# EAGLE design SensorBoard (EAGLE 9.6.2)
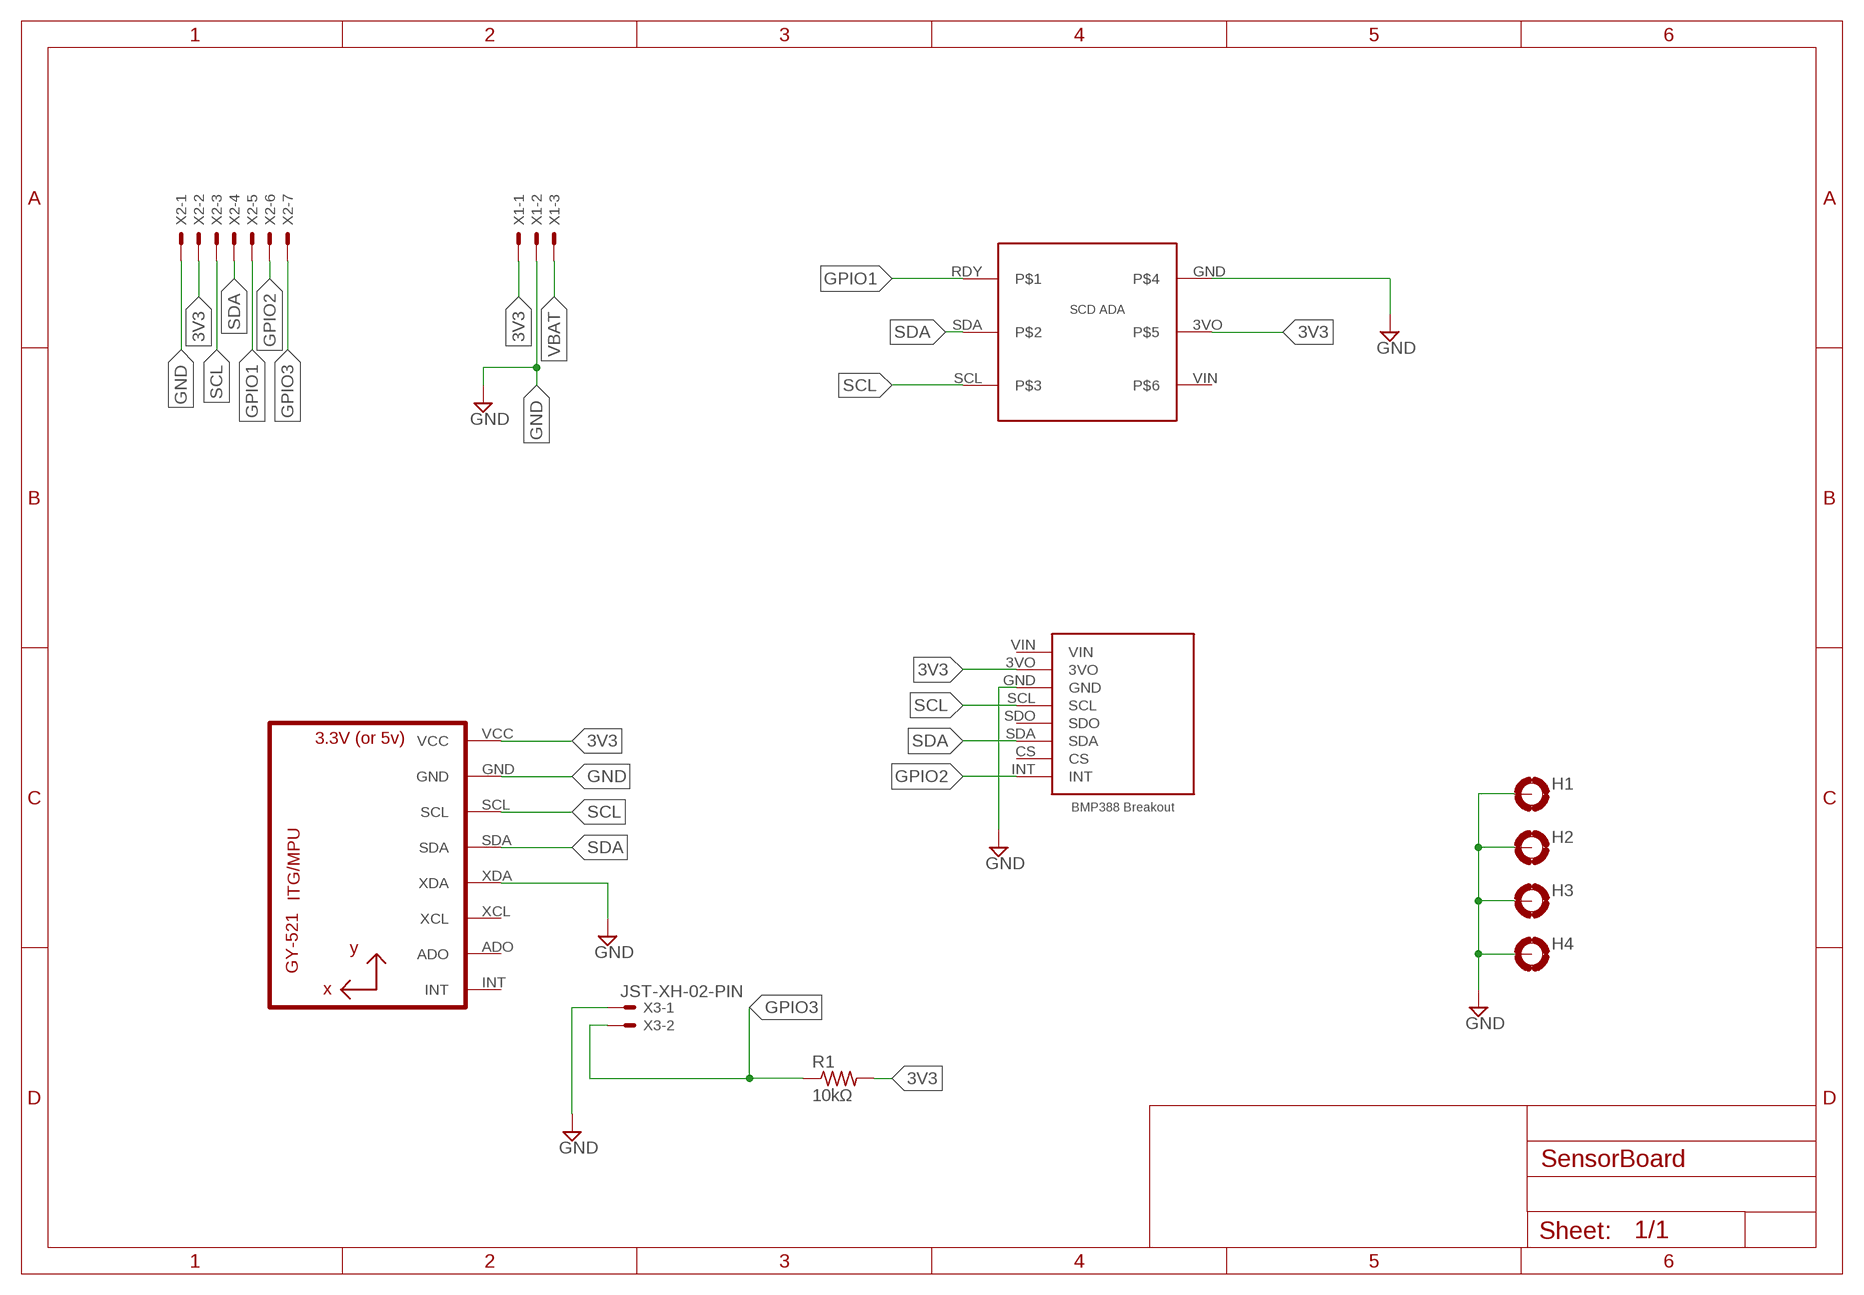
[diagram p0: schematic, sheet 1]

## Parts
H1  MOUNT-PAD-ROUND3.0  [3,0-PAD]
H2  MOUNT-PAD-ROUND3.0  [3,0-PAD]
H3  MOUNT-PAD-ROUND3.0  [3,0-PAD]
H4  MOUNT-PAD-ROUND3.0  [3,0-PAD]
R1  10kΩ  R-US_0204/7  [0204/7]
U1  GY-521MPU6050  [GY-521]
U$2  BMP388BREAKOUT  [BMP388BREAKOUT]
U$6  SCD30_ADA  [SCD30_ADA]
X1  JST-XH-03-PIN  [JST-XH_S3B]
X2  JST-XH-07-PIN  [JST-XH_S7B]
X3  JST-XH-02-PIN  [JST-XH_S2B]

## Nets
3V3: R1.2 U1.VCC U$2.3VO U$6.3VO X1.PIN1 X2.PIN2
GND: H1.B3,0(MOUNT) H2.B3,0(MOUNT) H3.B3,0(MOUNT) H4.B3,0(MOUNT) U1.GND U1.XDA U$2.GND U$6.GND X1.PIN2 X2.PIN1 X3.PIN1
GPIO1: U$6.RDY X2.PIN5
GPIO2: U$2.INT X2.PIN6
GPIO3: R1.1 X2.PIN7 X3.PIN2
SCL: U1.SCL U$2.SCL U$6.SCL X2.PIN3
SDA: U1.SDA U$2.SDA U$6.SDA X2.PIN4
VBAT: X1.PIN3
Unconnected: U1.ADO U1.INT U1.XCL U$2.CS U$2.SDO U$2.VIN U$6.VIN

## Library data of the parts
H1-H4 = holes:MOUNT-PAD-ROUND: MOUNTING PAD, round
R1 = rcl:R-US_: RESISTOR, American symbol; SPICEPREFIX: R
U1 = GY-521:GY-521: Check availability <https://pricing.snapeda.com/parts/GY-521/GODREAM%20FORDREAM%20CO.%2C%20LIMITED/view-part?ref=eda>; AVAILABILITY: Not in stock; CHECK_PRICES: https://www.snapeda.com/parts/GY-521/GODREAM+FORDREAM+CO.%252C+LIMITED/view-part/?ref=eda; DESCRIPTION: Triple Axis Accelerometer Gyro Breakout; MF: GODREAM FORDREAM CO., LIMITED; MP: GY-521; PACKAGE: Package; PRICE: None; SNAPEDA_LINK: https://www.snapeda.com/parts/GY-521/GODREAM+FORDREAM+CO.%252C+LIMITED/view-part/?ref=snap
U$2 = Breakouts:BMP388BREAKOUT: Adafruit BMP388 - Precision Barometric Pressure and Altimeter - STEMMA QT https://www.adafruit.com/product/3966
U$6 = SCD30:SCD30_ADA
X1 = JST-XH Connectors:JST-XH-03-PIN: JST XH Connector 2 Pin Wire to board connector. Pitch: 2,54 mm, (0.100") Number of pins: 3 Created by Rembrandt Electronics www.rembrandtelectronics.com
X2 = JST-XH Connectors:JST-XH-07-PIN: JST XH Connector 2 Pin Wire to board connector. Pitch: 2,54 mm, (0.100") Number of pins: 7 Created by Rembrandt Electronics www.rembrandtelectronics.com
X3 = JST-XH Connectors:JST-XH-02-PIN: JST XH Connector 2 Pin Wire to board connector. Pitch: 2,54 mm, (0.100") Number of pins: 2 Created by Rembrandt Electronics www.rembrandtelectronics.com

## Board
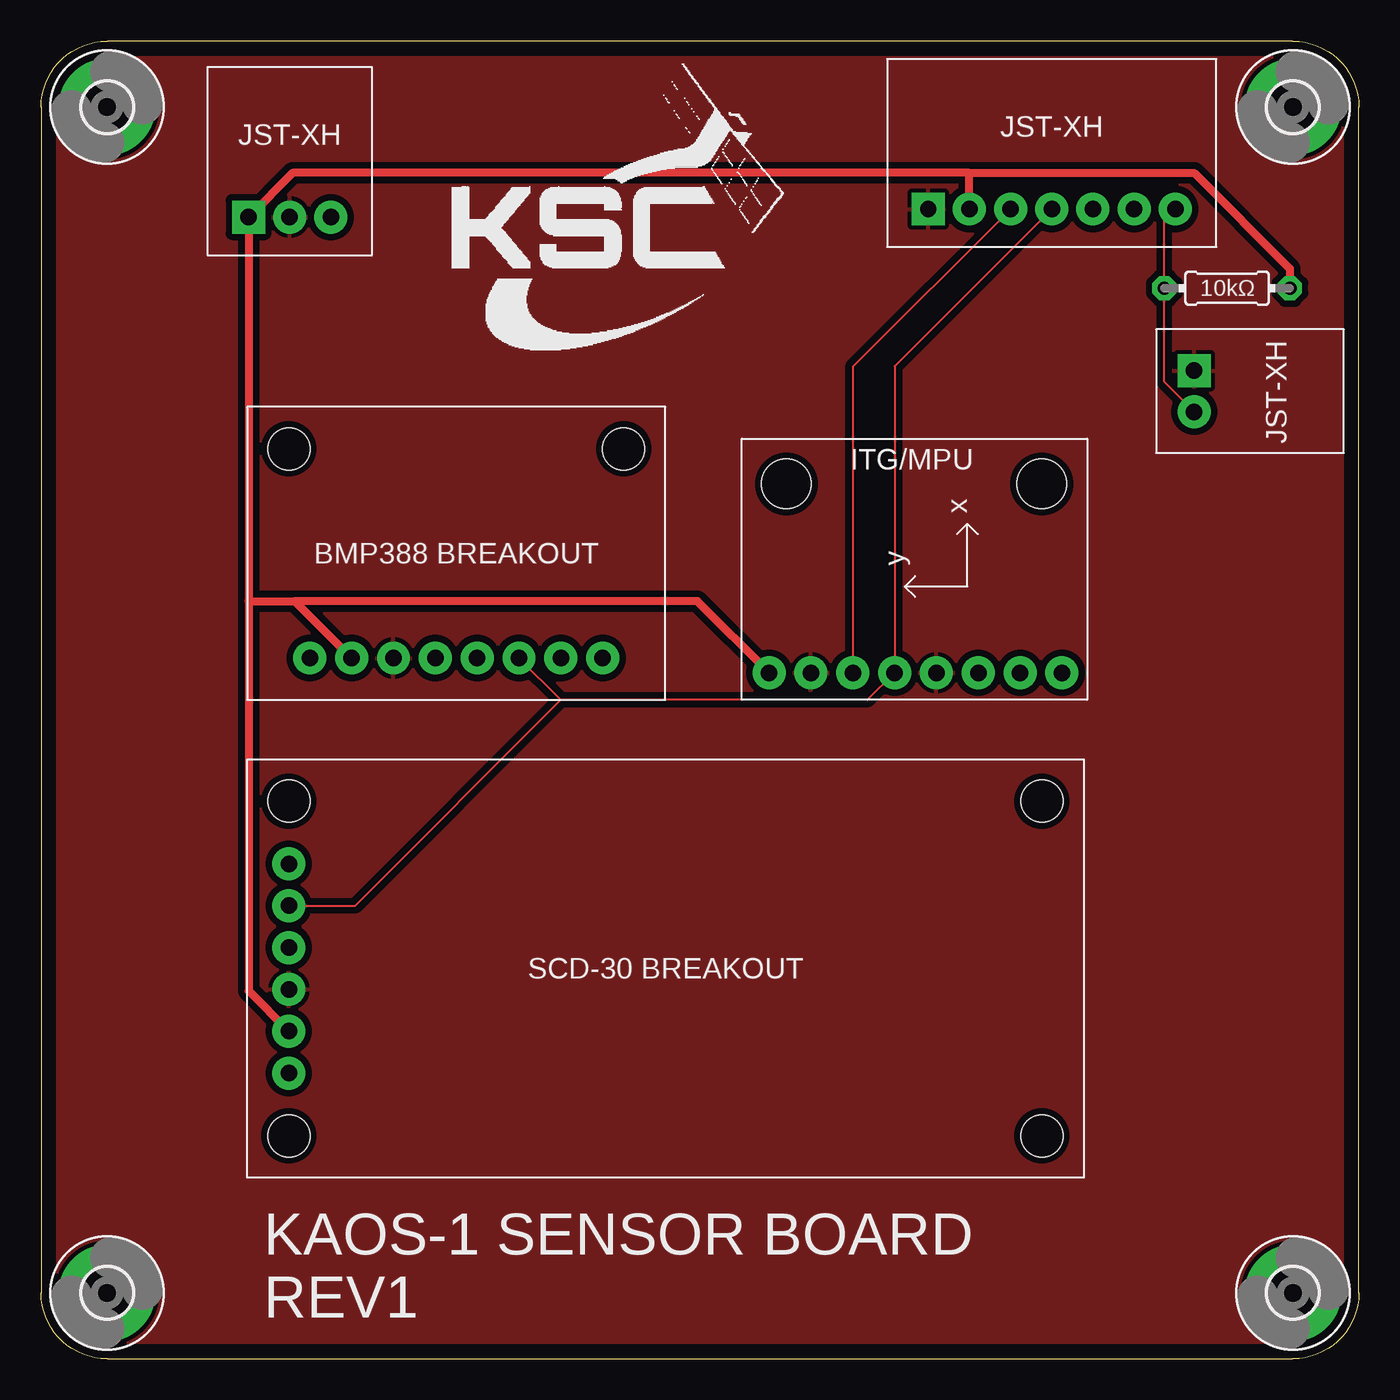
[diagram p1: board, top side]
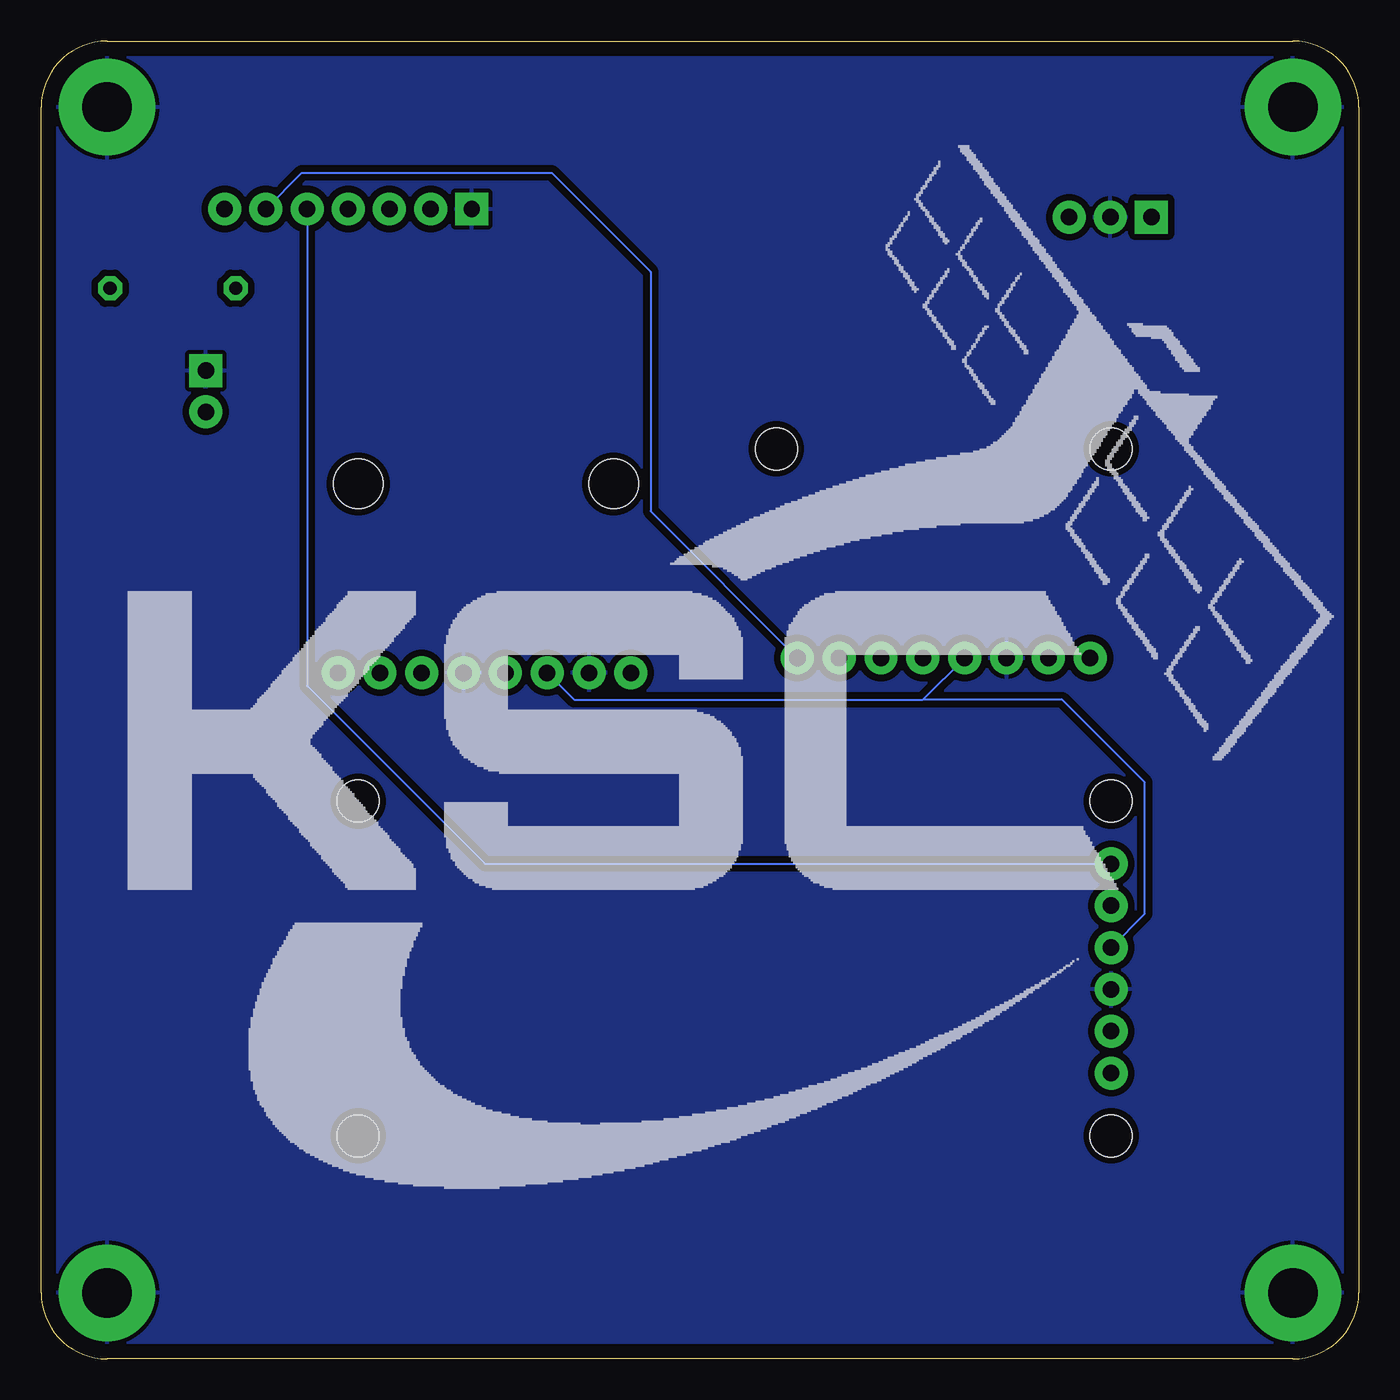
[diagram p2: board, bottom side, seen from below]

Size 80 x 80 mm. Coordinates in mm from the lower left corner, seen from the top.
Outline: 4,0 76,0 arc90 80,4 80,76 arc90 76,80 4,80 arc90 0,76 0,4 arc90 4,0
Copper layers (1*16): Top 0.035mm / dielectric 1.6mm / Bottom 0.035mm
Design rules "jlcpcb-2layers": minimum track width 5mil, minimum drill 0.3mm, track to track 5mil, track to pad 5mil, pad to pad 5mil, via to via 5mil, smd to smd 5mil, copper to edge 0.2mm, drill to drill 6mil, minimum pad ring 10mil, minimum via ring 3mil, stop-mask expansion 4mil, vias tented up to drill 0mil, thermal gap 10mil

### Footprints (pad centres in the part's own frame; a part is rotated, then mirrored left to right if it is on the bottom)
3,0-PAD = drill 3 pad 5.842: B3,0 0,0
0204/7 = drill 0.813 octagon: 1 -3.81,0; 2 3.81,0
GY-521 = drill 1 pad 2: ADO 1.651,4.064; GND 1.651,16.764; INT 1.651,1.524; SCL 1.651,14.224; SDA 1.651,11.684; VCC 1.651,19.304; XCL 1.651,6.604; XDA 1.651,9.144 | hole 3: 13.125,2.75; 13.125,18.25
BMP388BREAKOUT = drill 1 pad 2: 3VO -6.35,-6.35; CS 6.35,-6.35; GND -3.81,-6.35; INT 8.89,-6.35; SCL -1.27,-6.35; SDA 3.81,-6.35; SDO 1.27,-6.35; VIN -8.89,-6.35 | hole 2.54: 10.16,6.35; -10.16,6.35
SCD30_ADA = drill 1 pad 2: 3VO 2.54,8.89; GND 2.54,11.43; RDY 2.54,19.05; SCL 2.54,13.97; SDA 2.54,16.51; VIN 2.54,6.35 | hole 2.54: 2.54,2.54; 48.26,2.54; 48.26,22.86; 2.54,22.86
JST-XH_S3B = drill 1 pad 2 square: PIN1 0,0 | drill 1 pad 2: PIN2 2.5,0; PIN3 5,0
JST-XH_S7B = drill 1 pad 2 square: PIN1 0,0 | drill 1 pad 2: PIN2 2.5,0; PIN3 5,0; PIN4 7.5,0; PIN5 10,0; PIN6 12.5,0; PIN7 15,0
JST-XH_S2B = drill 1 pad 2 square: PIN1 0,0 | drill 1 pad 2: PIN2 2.5,0

### Placement (x,y rotation side)
H1  4,4 0 top
H2  76,4 0 top
H3  4,76 0 top
H4  76,76 0 top
R1  72,65 0 top
U1  63.5,40 90 top
U$2  25.2,48.9 0 top
U$6  12.5,11 0 top
X1  12.59,69.32 0 top
X2  53.86,69.81 0 top
X3  70,60 270 top

### Tracks (layer width: path | path; a pad name or v marks a point on that pad's centre or on a via)
3V3
  Top 0.5: 12.59,46 X1.PIN1 15.27,72 56.36,72 | 12.59,46 12.59,22.34 U$6.3VO | 12.59,46 15.4,46 | 15.4,46 U$2.3VO | U1.VCC 39.85,46 15.4,46 | X2.PIN2 56.36,72 | 56.36,72 70,72 75.81,66.19 R1.2
GND
  pour Top (isolate 0.4): 1,1 1,79 79,79 79,1
  pour Bottom (isolate 0.4): 1,1 1,79 79,79 79,1
GPIO1
  Bottom 0.127: X2.PIN5 63.86,40.86 53.05,30.05 U$6.RDY
GPIO2
  Bottom 0.127: U$2.INT 43,51.46 43,66 49,72 64.17,72 X2.PIN6
GPIO3
  Top 0.127: X3.PIN2 68.19,59.31 R1.1 68.19,69.14 X2.PIN7
SCL
  Top 0.127: X2.PIN3 49.28,60.23 U1.SCL
  Bottom 0.127: U1.SCL 47.62,40 27,40 26.48,40 | 26.48,40 U$2.SCL | U$6.SCL 13,27.01 13,35 18,40 26.48,40
SDA
  Top 0.127: X2.PIN4 51.82,60.27 U1.SDA 50.16,40 31.56,40 | 31.56,40 U$2.SDA | U$6.SDA 19.07,27.51 31.56,40

### Text on the board
tPlace: KAOS-1 SENSOR BOARD / REV1